# Altium schematic sheet Relay_Alert.SchDoc
size A
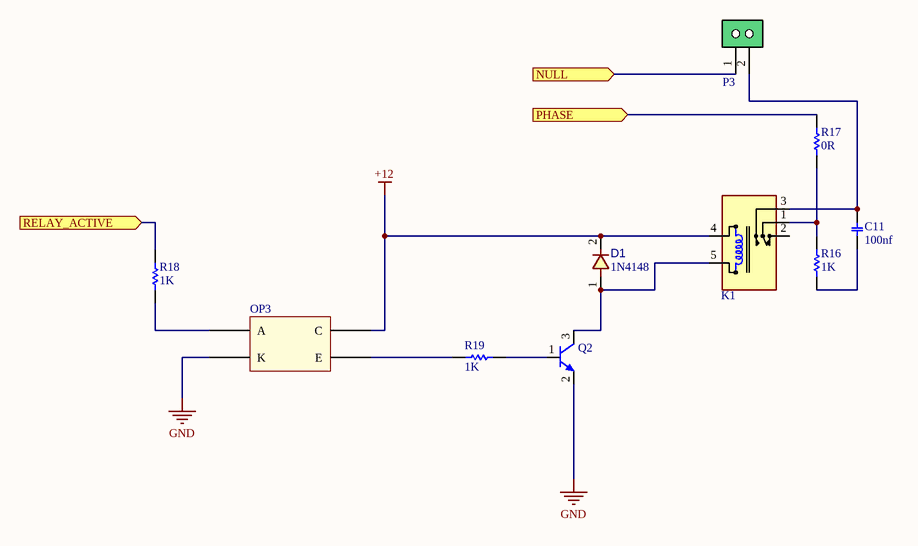
[diagram p0: Relay_Alert.SchDoc]

## Parts
C11  value 100nf  [C_PLY_13X5]  (hidden comment: Capacitor Polyester THD)
D1  value 1N4148  [D_SOD80]  (hidden comment: 1N4148 SMD)
K1  RELAY SPST 5 Pin Bache Millon  [REL_SPDT_5_1512]  (value not drawn)
OP3  PC817  [PC817 SMD]  (value not drawn)
P3  Phoenix 2  [PRKR2A]  (value not drawn)
Q2  BC847 NPN  [SOT-23]  (value not drawn)
R16  value 1K  [R05W_AX05]  (hidden comment: Resistor THD)
R17  value 0R  [SMD-1206-RES]  (hidden comment: Resistor SMD 1206)
R18  value 1K  [SMD-1206-RES]  (hidden comment: Resistor SMD 1206)
R19  value 1K  [SMD-1206-RES]  (hidden comment: Resistor SMD 1206)

## Ports
NULL (in), PHASE (in), RELAY_ACTIVE (in)

## Nets
+12: D1.2 K1.4(T1) OP3.4(C)
GND: OP3.2(K) Q2.2(E)
NULL: P3.1 ; port NULL
PHASE: R17.2 ; port PHASE
RELAY_ACTIVE: R18.2 ; port RELAY_ACTIVE
NetC11_1: C11.1 R16.1
NetC11_2: C11.2 K1.3(NO) P3.2
NetD1_1: D1.1 K1.5(T2) Q2.3(C)
NetK1_1: K1.1(COM) R16.2 R17.1
NetOP3_1: OP3.1(A) R18.1
NetOP3_3: OP3.3(E) R19.1
NetQ2_1: Q2.1(B) R19.2

Not connected (* = marked no-connect by the designer): K1 2(NC)

## Library data of the parts
D1 = 1N4148 SMD: DIODE, FAST SWTICHING, 0.3A, 0.5W; DatasheetVersion: 2021; ComponentLink1Description: Website Smart World; ComponentLink1URL: https://www.smartw.ir/; ComponentLink2Description: Telegram; ComponentLink2URL: https://t.me/altium_smartw; ComponentLink3Description: Instagram; ComponentLink3URL: https://Instagram.com/smartgw.ir
K1 = RELAY SPST 5 Pin Bache Millon: Relay; ComponentLinkp-URL: https://www.smartw.ir/; DatasheetVersion: 2021; ComponentLink1Description: Website Smart World; ComponentLink1URL: https://www.smartw.ir/; ComponentLink2Description: Telegram; ComponentLink2URL: https://t.me/altium_smartw; ComponentLink3Description: Instagram; ComponentLink3URL: https://Instagram.com/smartgw.ir
OP3 = PC817: PC817 optocpler; ComponentLink2Description: Website Smart World; ComponentLink2URL: https://www.smartw.ir/; ComponentLink3Description: Telegram; ComponentLink3URL: https://t.me/altium_smartw; ComponentLink4Description: Instagram; ComponentLink4URL: https://Instagram.com/smartgw.ir; DatasheetVersion: 2021
Q2 = BC847 NPN: BJT, NPN, 45v, 0.1A, SOT23; ComponentLink1Description: Website Smart World; ComponentLink1URL: https://www.smartw.ir/; ComponentLink2Description: Telegram; ComponentLink2URL: https://t.me/altium_smartw; ComponentLink3Description: Instagram; ComponentLink3URL: https://Instagram.com/smartgw.ir; DatasheetVersion: 2021; Value: BC847
C11 = Capacitor Polyester THD: DatasheetVersion: 2021; ComponentLink1Description: Website Smart World; ComponentLink1URL: https://www.smartw.ir/; ComponentLink2Description: Telegram; ComponentLink2URL: https://t.me/altium_smartw; ComponentLink3Description: Instagram; ComponentLink3URL: https://Instagram.com/smartgw.ir
P3 = Phoenix 2: ComponentLinkp-URL: https://www.smartw.ir/; DatasheetVersion: 2021; ComponentLink1Description: Website Smart World; ComponentLink1URL: https://www.smartw.ir/; ComponentLink2Description: Telegram; ComponentLink2URL: https://t.me/altium_smartw; ComponentLink3Description: Instagram; ComponentLink3URL: https://Instagram.com/smartgw.ir
R16 = Resistor THD: DatasheetVersion: 2021; ComponentLink1Description: Website Smart World; ComponentLink1URL: https://www.smartw.ir/; ComponentLink2Description: Telegram; ComponentLink2URL: https://t.me/altium_smartw; ComponentLink3Description: Instagram; ComponentLink3URL: https://Instagram.com/smartgw.ir
R17-R19 = Resistor SMD 1206: DatasheetVersion: 2021; ComponentLink1Description: Website Smart World; ComponentLink1URL: https://www.smartw.ir/; ComponentLink2Description: Telegram; ComponentLink2URL: https://t.me/altium_smartw; ComponentLink3Description: Instagram; ComponentLink3URL: https://Instagram.com/smartgw.ir